# EAGLE design Optoisolator (EAGLE 6.2)
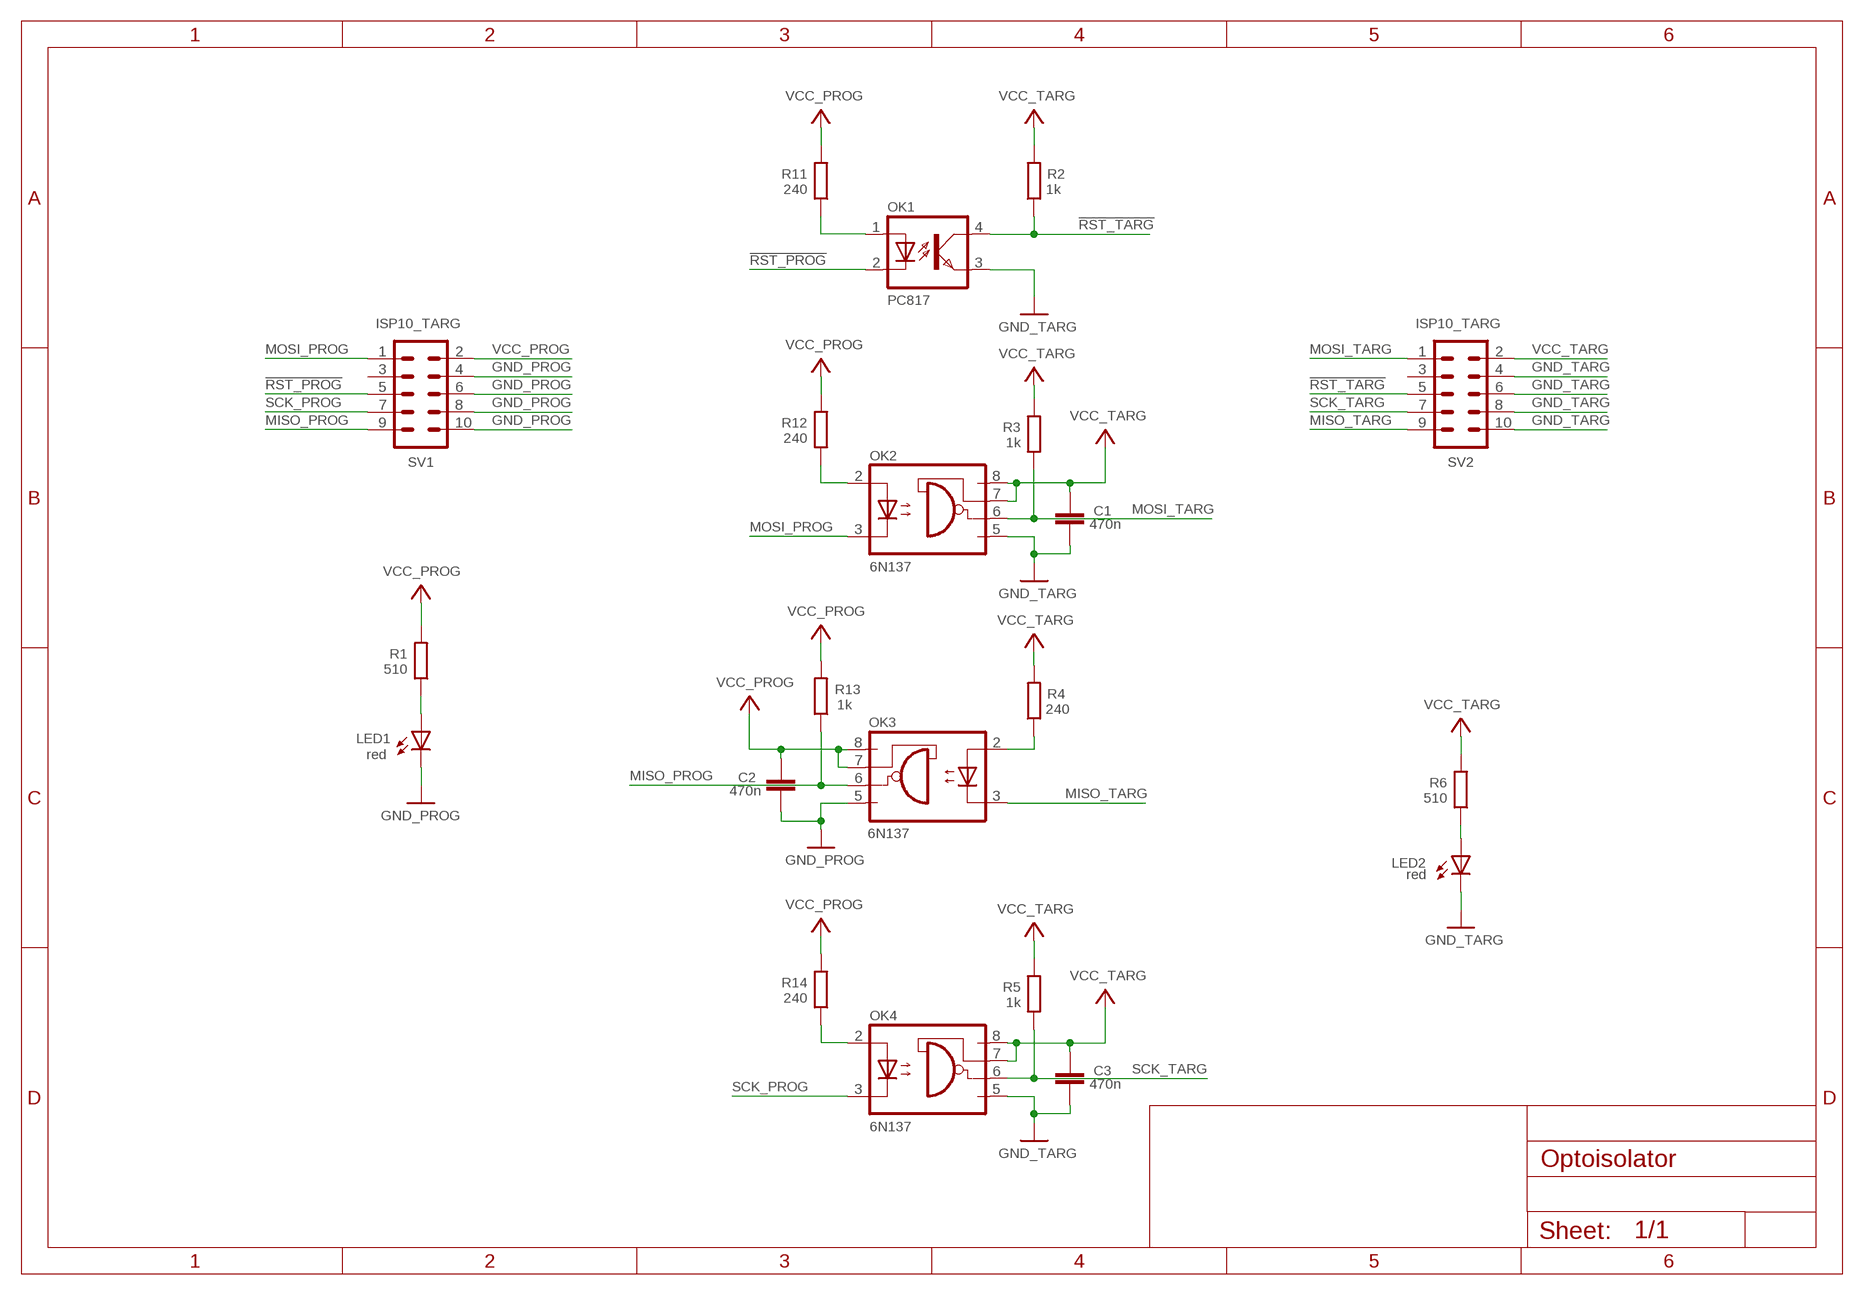
[diagram p0: schematic, sheet 1]

## Parts
C1  470n  CAPC1206  [C1206]
C2  470n  CAPC1206  [C1206]
C3  470n  CAPC1206  [C1206]
LED1  red  LED3MM  [LED3MM]
LED2  red  LED3MM  [LED3MM]
OK1  PC817  [DIL04]
OK2  6N137  [DIL08]
OK3  6N137  [DIL08]
OK4  6N137  [DIL08]
R1  510  RESR1206  [R1206]
R2  1k  RESR1206  [R1206]
R3  1k  RESR1206  [R1206]
R4  240  RESR1206  [R1206]
R5  1k  RESR1206  [R1206]
R6  510  RESR1206  [R1206]
R11  240  RESR1206  [R1206]
R12  240  RESR1206  [R1206]
R13  1k  RESR1206  [R1206]
R14  240  RESR1206  [R1206]
SV1  ISP10_TARG  ML10  [ML10]
SV2  ISP10_TARG  ML10  [ML10]

## Nets
!RST_PROG: OK1.2(C) SV1.5
!RST_TARG: OK1.4(COL) R2.1 SV2.5
GND_PROG: C2.2 LED1.K(C) OK3.5(GND) SV1.4 SV1.6 SV1.8 SV1.10
GND_TARG: C1.2 C3.2 LED2.K(C) OK1.3(EMIT) OK2.5(GND) OK4.5(GND) SV2.4 SV2.6 SV2.8 SV2.10
MISO_PROG: OK3.6(VO) R13.1 SV1.9
MISO_TARG: OK3.3(C) SV2.9
MOSI_PROG: OK2.3(C) SV1.1
MOSI_TARG: OK2.6(VO) R3.1 SV2.1
N$1: OK1.1(A) R11.1
N$2: OK2.2(A) R12.1
N$3: OK4.2(A) R14.1
N$4: LED2.A R6.1
N$5: LED1.A R1.1
N$12: OK3.2(A) R4.1
SCK_PROG: OK4.3(C) SV1.7
SCK_TARG: OK4.6(VO) R5.1 SV2.7
VCC_PROG: C2.1 OK3.7(VE) OK3.8(VCC) R1.2 R11.2 R12.2 R13.2 R14.2 SV1.2
VCC_TARG: C1.1 C3.1 OK2.7(VE) OK2.8(VCC) OK4.7(VE) OK4.8(VCC) R2.2 R3.2 R4.2 R5.2 R6.2 SV2.2
Unconnected: SV1.3 SV2.3

## Library data of the parts
C1-C3 = Passive-PoE-ClassB:CAP: CAPACITOR, European symbol
LED1 LED2 = Optoisolator:LED
OK1 = Optoisolator:PC817: SHARP OPTO COUPLER; MPN: PC817X4J000F; OC_FARNELL: 9707727; OC_NEWARK: 97K7059
OK2-OK4 = Optoisolator:6N137: MOTOROLA OPTO COUPLER; MPN: 6N137; OC_FARNELL: 1328376; OC_NEWARK: 52M1895
R1-R6 R11-R14 = Passive-PoE-ClassB:RES: RESISTOR, European symbol
SV1 SV2 = Optoisolator:ML10: HARTING; OC_FARNELL: unknown; OC_NEWARK: unknown

## Board
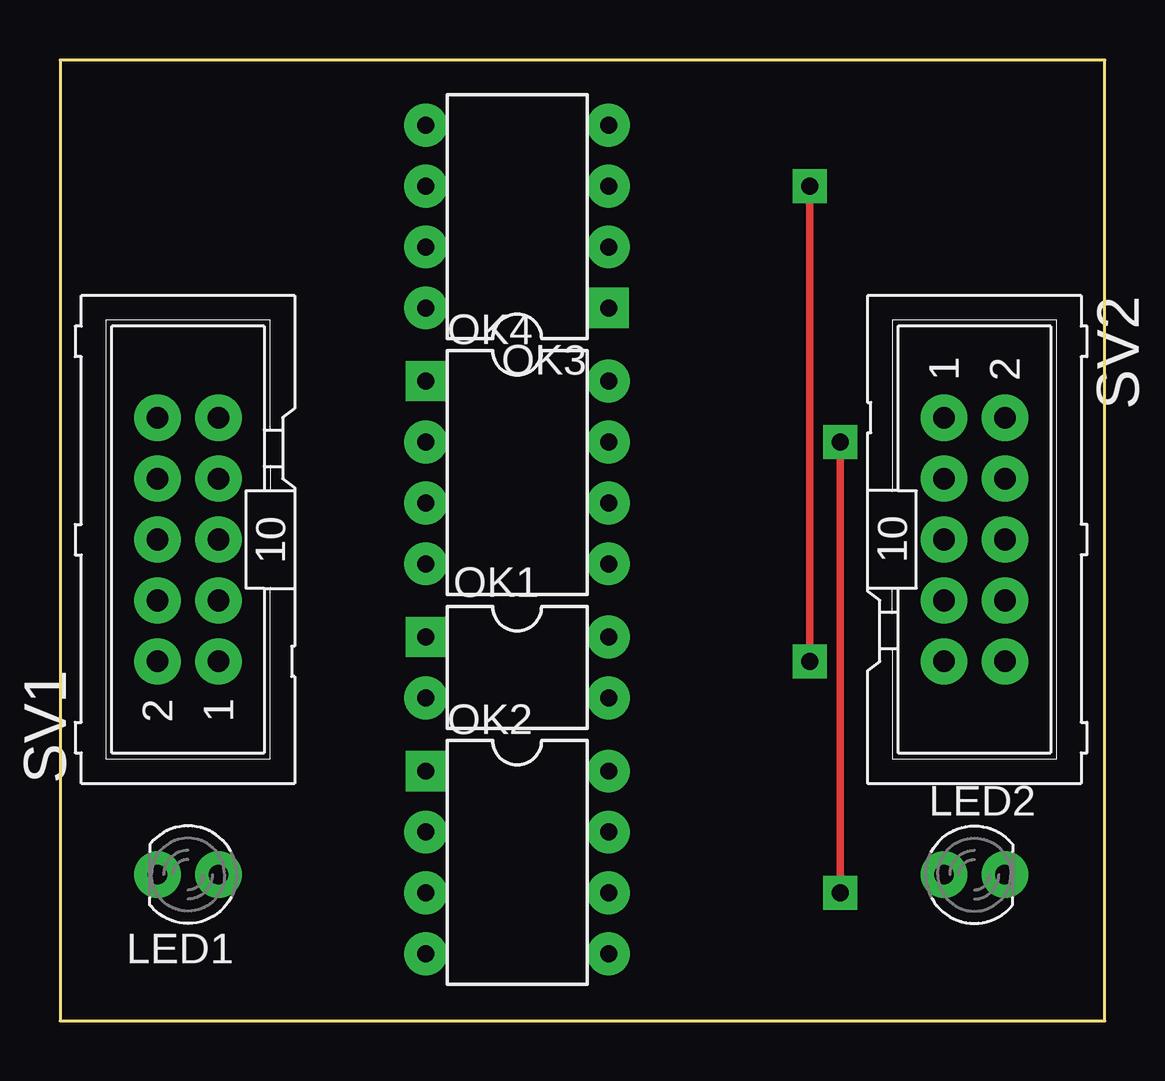
[diagram p1: board, top side]
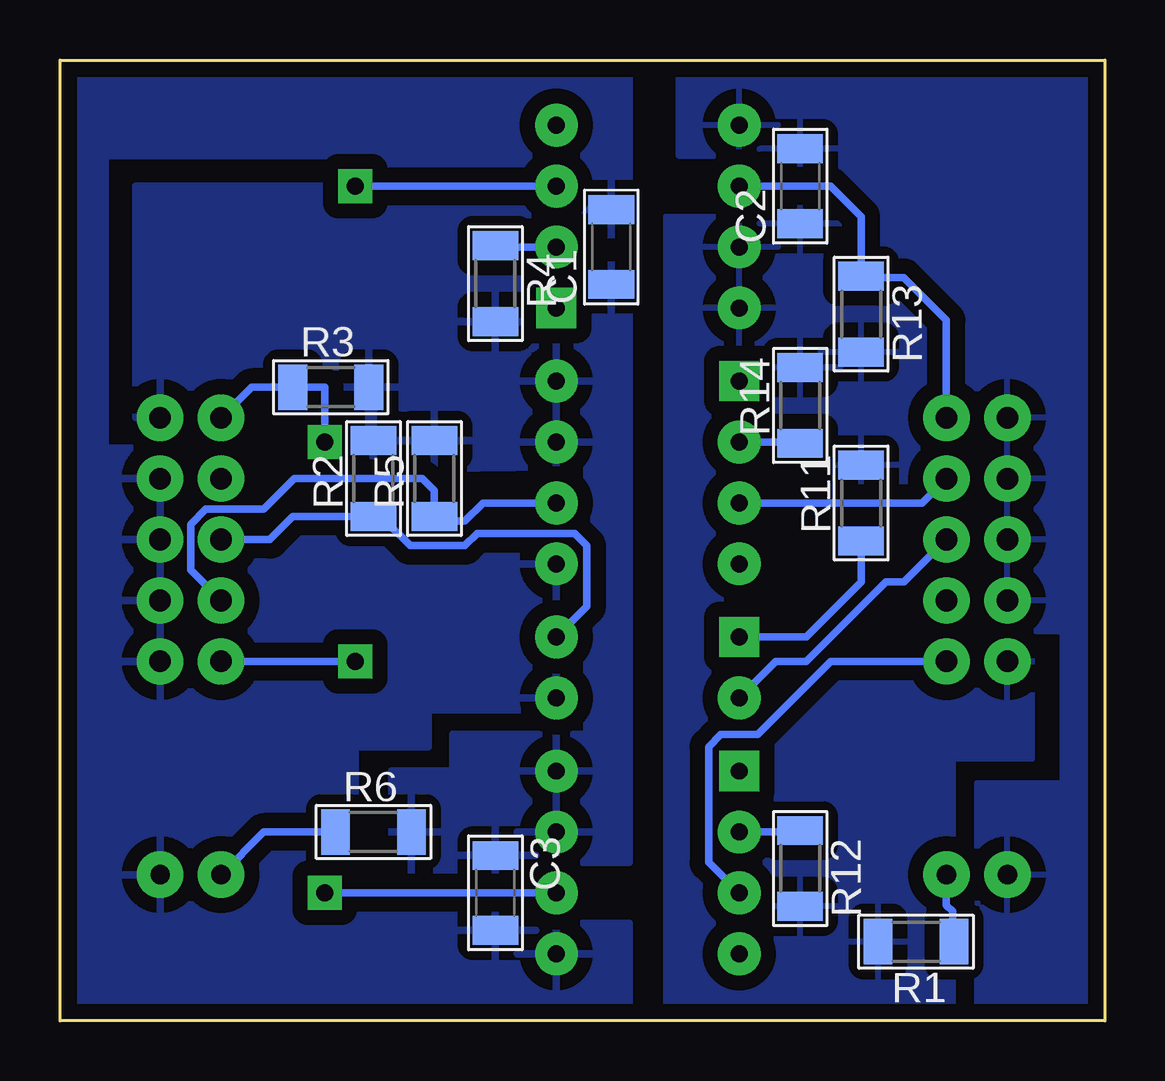
[diagram p2: board, bottom side, seen from below]

Size 43.54 x 40.06 mm. Coordinates in mm from the lower left corner, seen from the top.
Outline: 0,0 43.54,0 43.54,40.06 0,40.06 0,0
Copper layers (1*16): Top 0.035mm / dielectric 1.5mm / Bottom 0.035mm
Design rules: minimum track width 15mil, minimum drill 24mil, track to track 25mil, track to pad 25mil, pad to pad 8mil, via to via 8mil, smd to smd 8mil, copper to edge 25mil, drill to drill 8mil, minimum pad ring 10mil, minimum via ring 8mil, stop-mask expansion 4mil, vias tented up to drill 0mil, thermal gap 25mil

### Footprints (pad centres in the part's own frame; a part is rotated, then mirrored left to right if it is on the bottom)
C1206 = smd 1.2 x 1.9: 1 -1.559,0; 2 1.559,0
LED3MM = drill 0.8 pad 1.93: A -1.27,0; K 1.27,0
DIL04 = drill 0.7 pad 1.676 square: 1 -1.27,-3.81 | drill 0.7 pad 1.778: 2 1.27,-3.81; 3 1.27,3.81; 4 -1.27,3.81
DIL08 = drill 0.7 pad 1.676 square: 1 -3.81,-3.81 | drill 0.7 pad 1.778: 2 -1.27,-3.81; 3 1.27,-3.81; 4 3.81,-3.81; 5 3.81,3.81; 6 1.27,3.81; 7 -1.27,3.81; 8 -3.81,3.81
R1206 = smd 1.2 x 1.9: 1 -1.581,0; 2 1.581,0
ML10 = drill 0.9 pad 1.93: 1 -5.08,-1.27; 2 -5.08,1.27; 3 -2.54,-1.27; 4 -2.54,1.27; 5 0,-1.27; 6 0,1.27; 7 2.54,-1.27; 8 2.54,1.27; 9 5.08,-1.27; 10 5.08,1.27

### Placement (x,y rotation side)
C1  20.57,32.26 90 bottom
C2  12.7,34.8 90 bottom
C3  25.4,5.33 270 bottom
LED1  5.33,6.1 180 top
LED2  38.1,6.1 0 top
OK1  19.05,14.73 270 top
OK2  19.05,6.6 270 top
OK3  19.05,33.53 90 top
OK4  19.05,22.86 270 top
R1  7.87,3.3 180 bottom
R2  30.48,22.61 90 bottom
R3  32.26,26.42 0 bottom
R4  25.4,30.73 270 bottom
R5  27.94,22.61 90 bottom
R6  30.48,7.87 0 bottom
R11  10.16,21.59 90 bottom
R12  12.7,6.35 270 bottom
R13  10.16,29.46 270 bottom
R14  12.7,25.65 90 bottom
SV1  5.33,20.07 90 top
SV2  38.1,20.07 270 top

### Tracks (layer width: path | path; a pad name or v marks a point on that pad's centre or on a via)
!RST_PROG
  Bottom 0.305: SV1.5 8.38,18.29 9.14,18.29 12.45,14.99 13.72,14.99 OK1.2
!RST_TARG
  Bottom 0.305: SV2.5 34.8,20.07 33.84,21.03 R2.1 30.17,21.03 28.96,19.81 26.67,19.81 26.16,20.32 22.1,20.32 21.59,19.81 21.59,17.27 OK1.4
GND_PROG
  pour Bottom: 0,39.88 17.78,39.88 17.78,36.07 15.24,36.07 15.24,34.8 11.43,34.8 10.16,33.53 10.16,30.99 8.38,30.99 6.6,29.21 6.6,16.26 1.78,16.26 1.78,9.91 5.33,9.91 5.33,0.25 0,0.25
GND_TARG
  pour Bottom: 19.81,0.25 43.43,0.25 43.43,39.62 19.81,39.62 19.81,32.77 22.86,32.77 22.86,34.8 31.24,34.8 31.24,36.07 41.66,36.07 41.66,23.88 38.1,23.88 38.1,21.08 22.86,21.08 22.86,12.95 28.19,12.95 28.19,11.43 31.24,11.43 31.24,5.33 22.86,5.33 22.86,4.06 19.81,4.06
MISO_PROG
  Bottom 0.305: SV1.9 6.6,29.21 8.38,30.99 10.1,30.99 R13.1 10.16,33.53 11.43,34.8 OK3.6
MISO_TARG  (via drill 0.7 pad 1.42)
  Top 0.305: v31.24,14.99 v31.24,34.8
  Bottom 0.305: SV2.9 v31.24,14.99 | v31.24,34.8 OK3.3
MOSI_PROG
  Bottom 0.305: SV1.1 11.43,14.99 14.48,11.94 16,11.94 16.51,11.43 16.51,6.6 OK2.3
MOSI_TARG  (via drill 0.7 pad 1.42)
  Top 0.305: v32.51,5.33 v32.51,24.13
  Bottom 0.305: OK2.6 v32.51,5.33 | 33.78,25.91 33.78,26.36 R3.1 | R3.1 35.56,26.42 SV2.1 | v32.51,24.13 32.51,26.42 R3.1
N$1
  Bottom 0.305: OK1.1 12.45,16 10.16,18.29 R11.1
N$2
  Bottom 0.305: OK2.2 12.76,7.87 R12.1
N$3
  Bottom 0.305: OK4.2 12.76,24.13 R14.1
N$4
  Bottom 0.305: R6.1 35.05,7.87 LED2.A
N$5
  Bottom 0.305: 6.6,3.36 R1.1 6.35,3.36 6.35,4.57 6.6,4.83 LED1.A
N$12
  Bottom 0.305: OK3.2 25.34,32.26 R4.1
SCK_PROG
  Bottom 0.305: OK4.3 7.62,21.59 SV1.7
SCK_TARG
  Bottom 0.305: OK4.6 25.91,21.59 26.67,20.83 27.74,20.83 R5.1 27.94,22.1 28.45,22.61 33.78,22.61 35.05,21.34 37.47,21.34 38.1,20.7 38.1,18.8 SV2.7
VCC_PROG
  pour Bottom: 3.05,16.26 3.05,10.92 6.35,10.92 6.35,0.25 18.29,0.25 18.29,33.53 15.24,33.53 15.24,34.8 11.43,34.8 10.16,33.53 10.16,30.99 8.38,30.99 6.6,29.21 6.6,16.26
VCC_TARG
  pour Bottom: 40.39,34.8 22.86,34.8 22.86,31.5 19.81,31.5 19.81,6.6 22.86,6.6 22.86,5.33 29.72,5.33 29.72,10.41 27.18,10.41 27.18,11.94 21.59,11.94 21.59,23.11 39.37,22.86 39.37,25.15 40.39,25.15